# EAGLE schematic Motherboard - Rev2 (EAGLE 9.5.2)
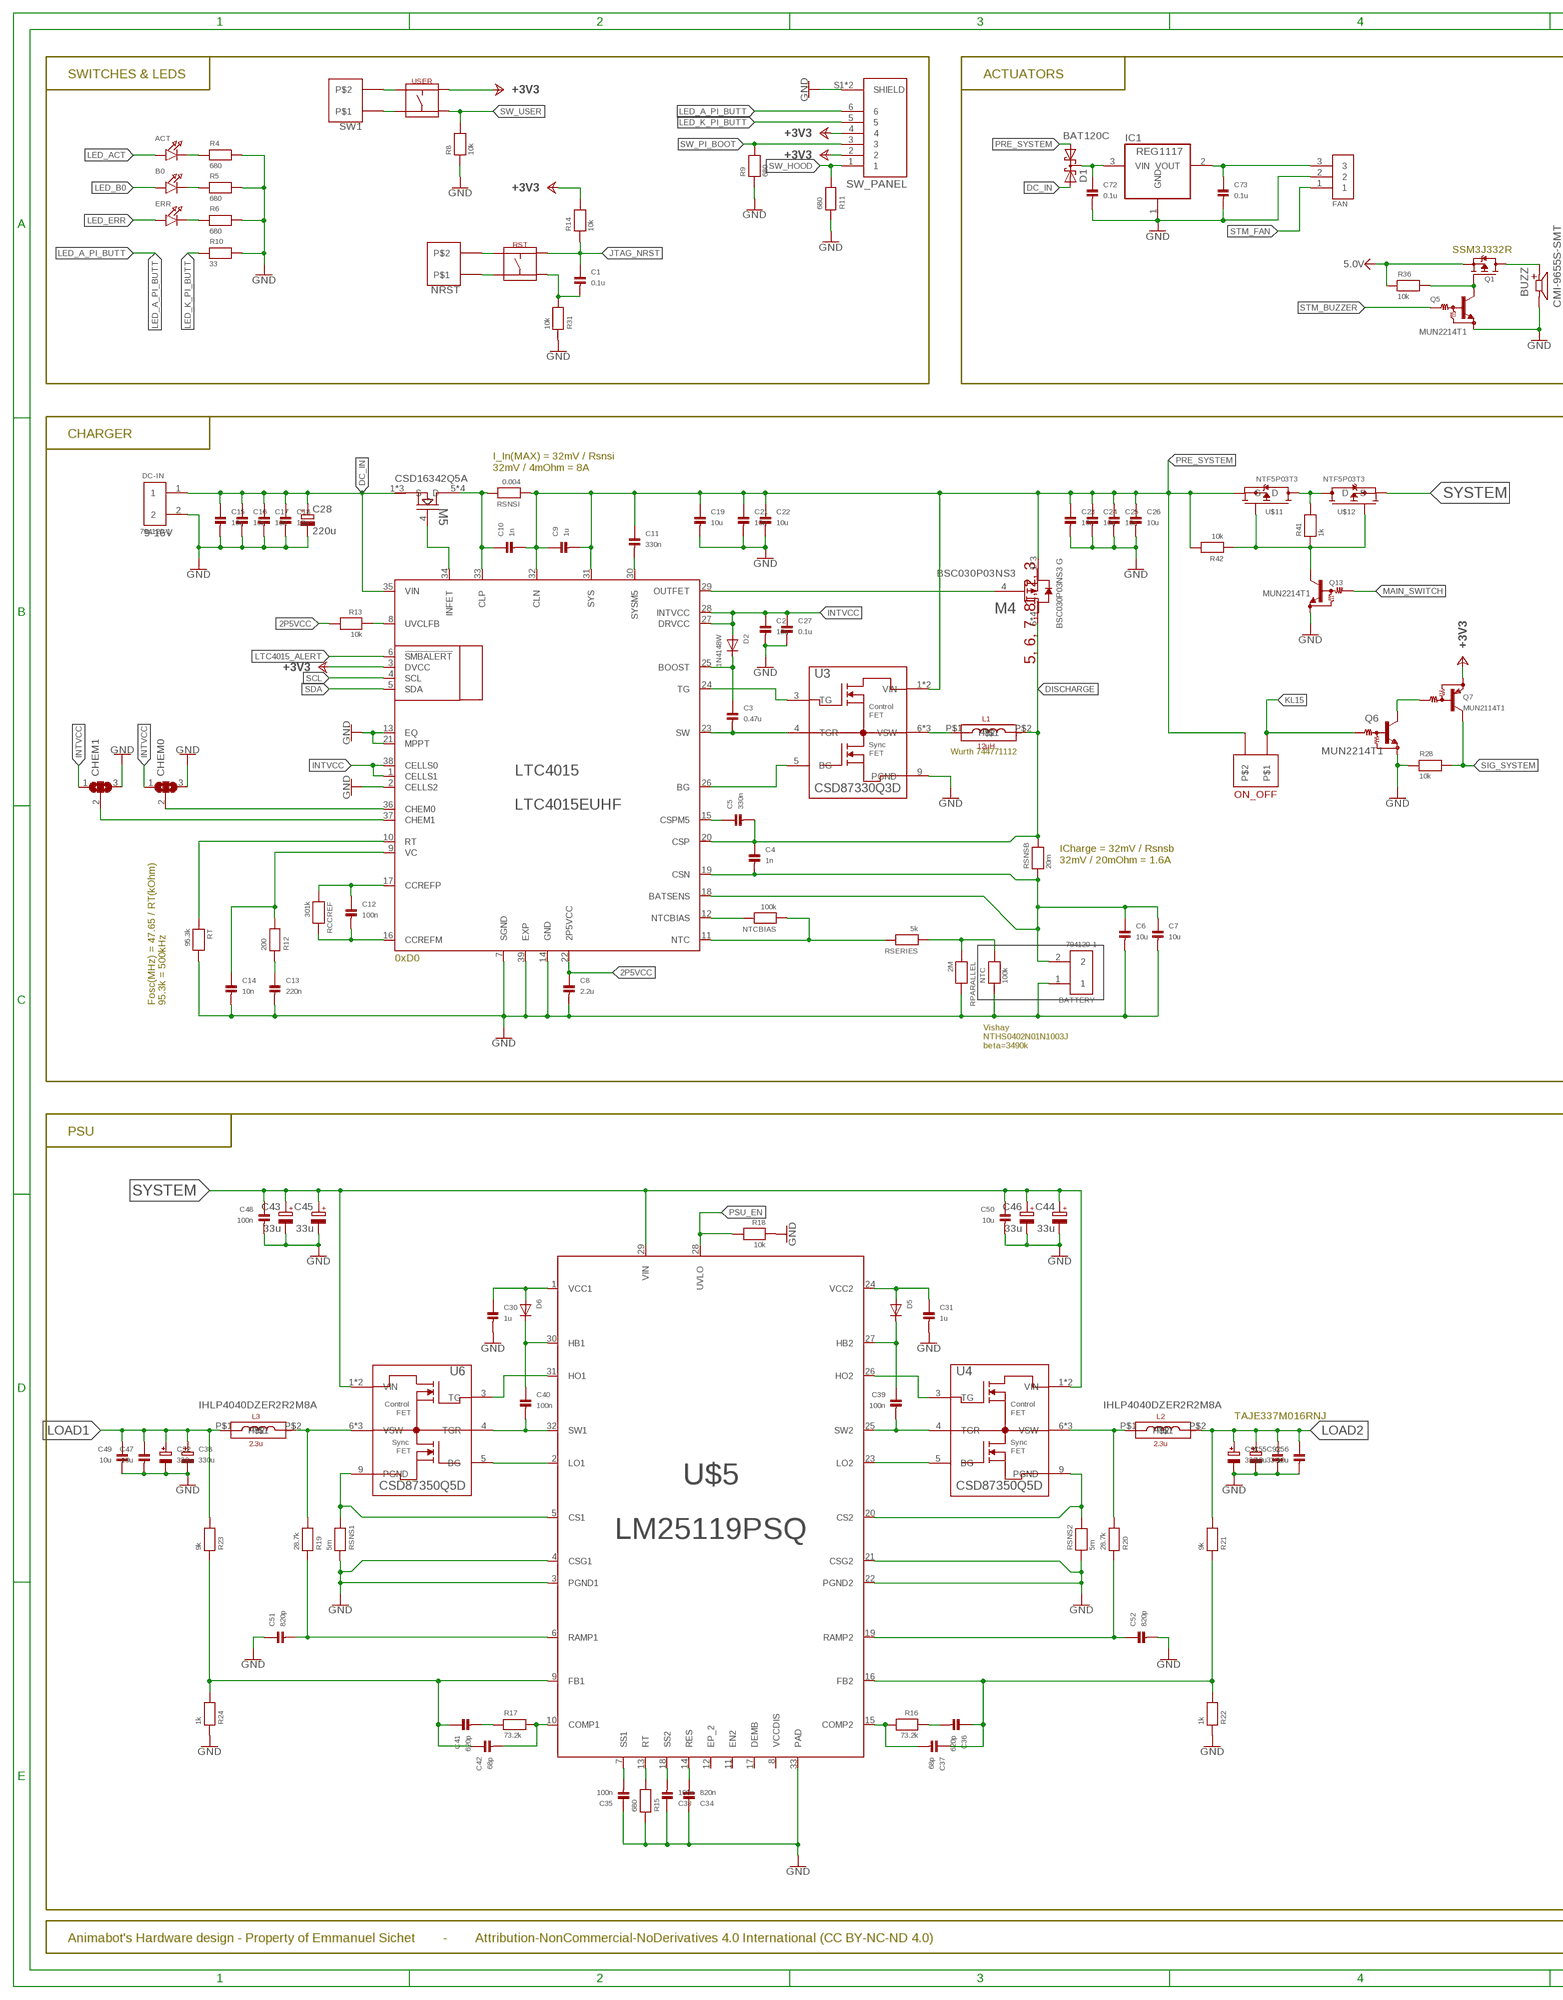
[diagram p0: schematic, sheet 1, part 1 of 2]
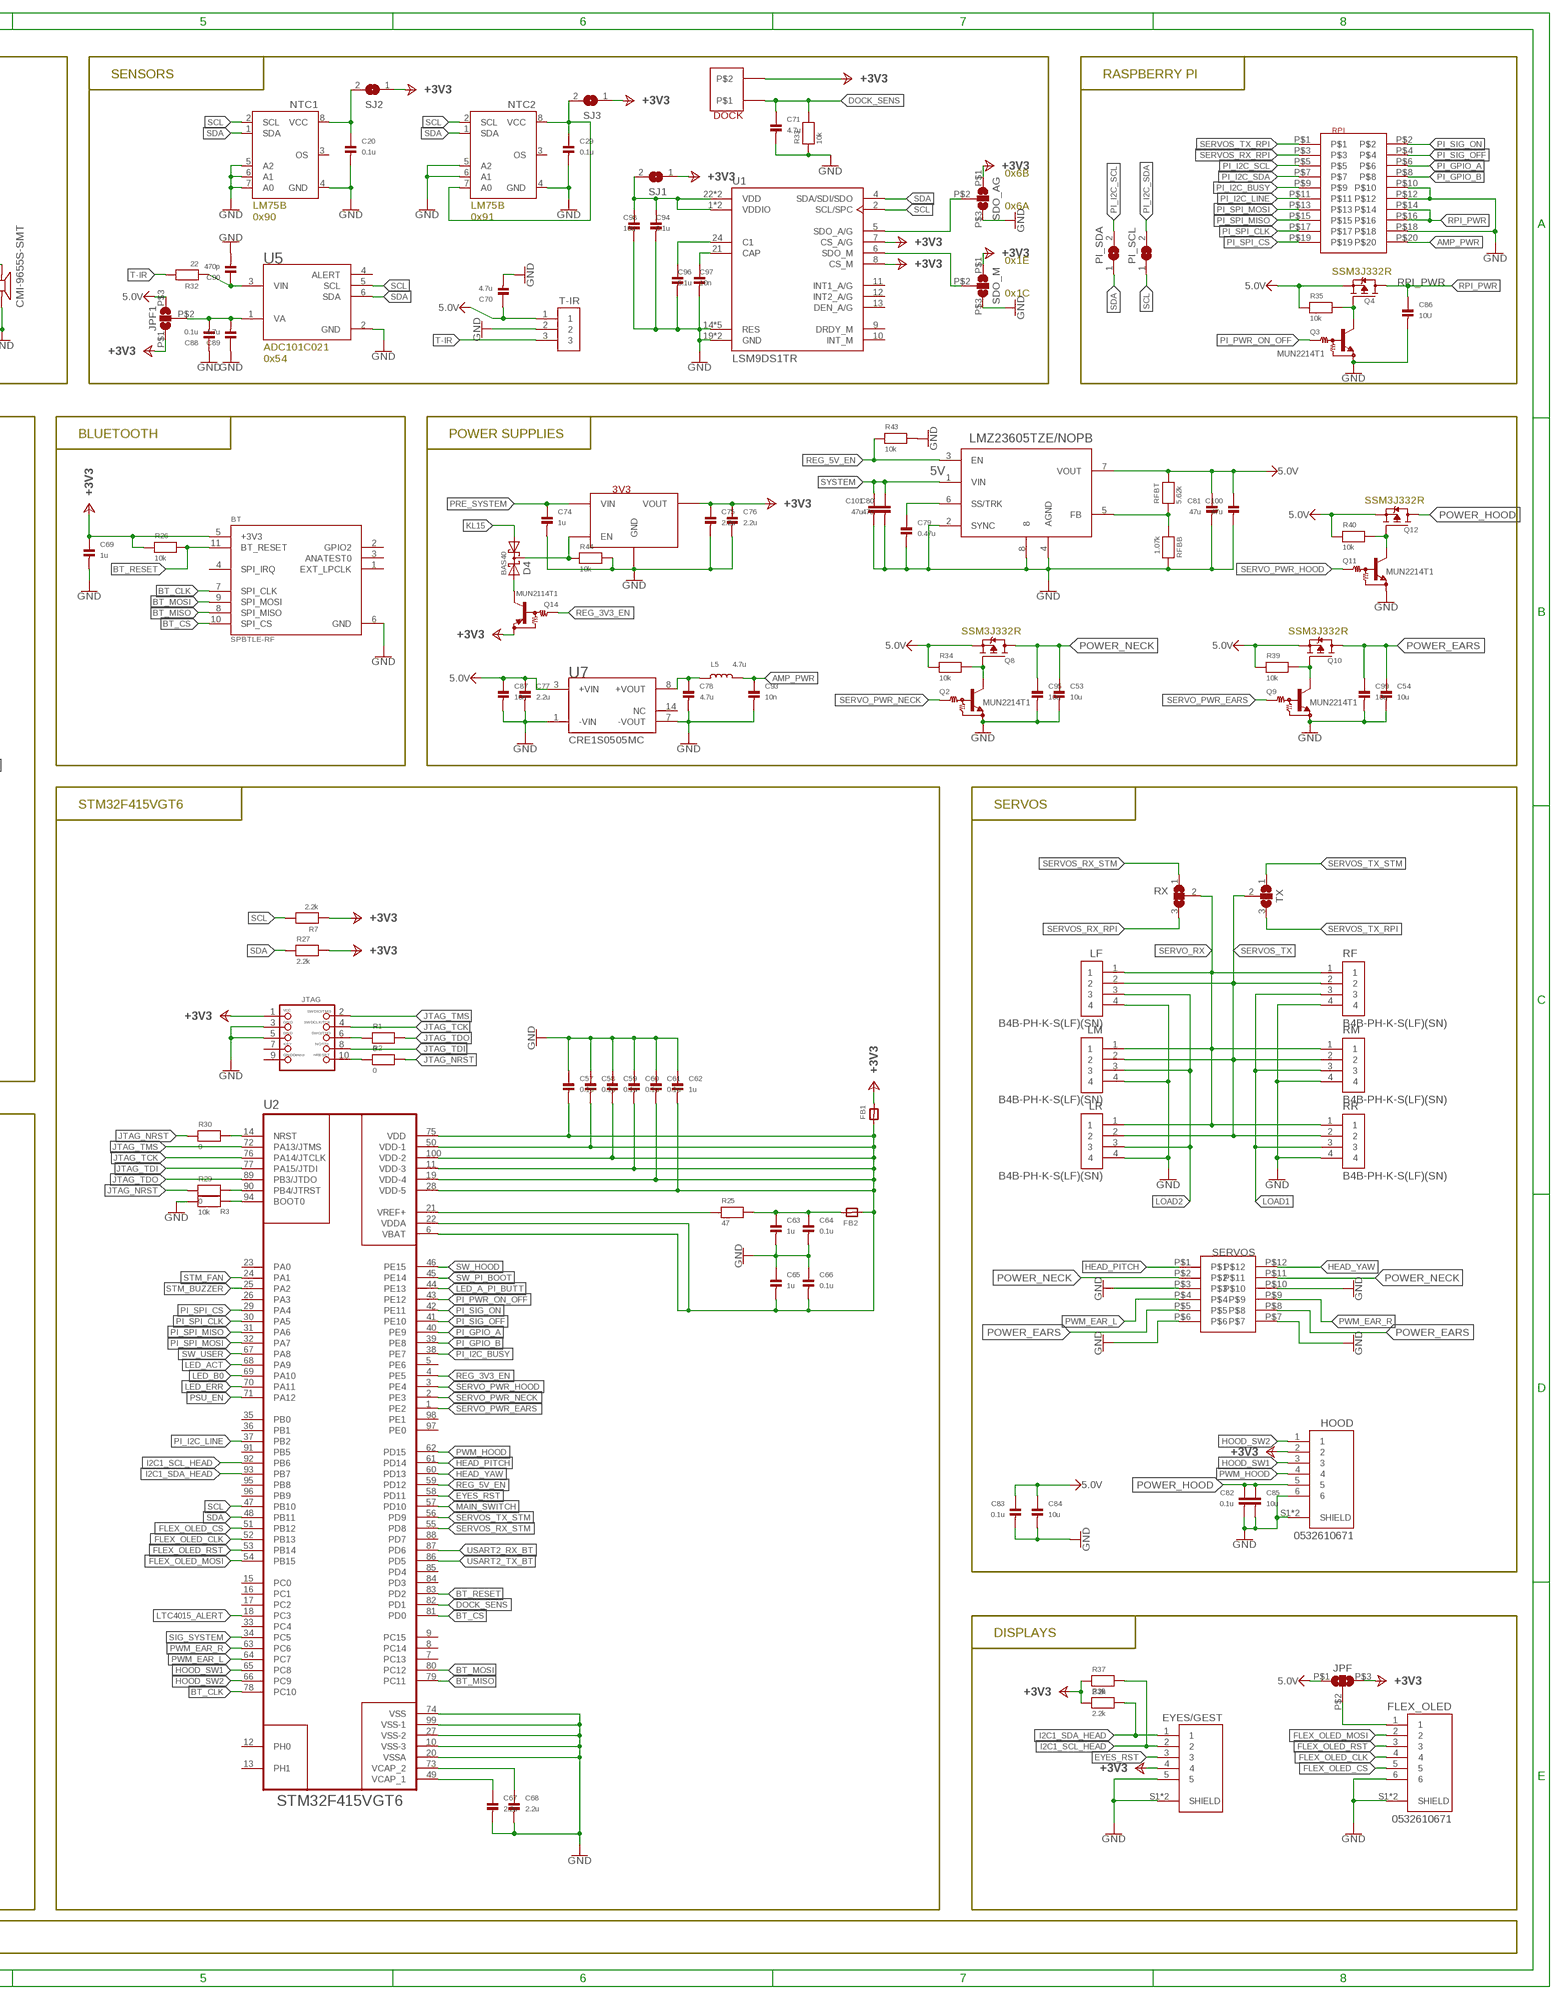
[diagram p1: schematic, sheet 1, part 2 of 2]

## Parts
3V3  NCP5500DT-33.50-RKG  [NCP5500DT-33.50-RKG]
5V  LMZ23605TZE/NOPB  [TZA07A]
ACT  LED0805  [CHIPLED_0805]
B0  LED0805  [CHIPLED_0805]
BATTERY  794120-1  [TE_794120-1]
BT  SPBTLE-RF  [XCVR_SPBTLE-RF]
BUZZ  CMI-9655S-SMT  [CUI_CMI-9655S-SMT]
C1  0.1u  CAP_CERAMIC0805  [0805]
C2  10u  CAP_CERAMIC0805  [0805]
C3  0.47u  CAP_CERAMIC0805  [0805]
C4  1n  CAP_CERAMIC0805  [0805]
C5  330n  CAP_CERAMIC0805  [0805]
C6  10u  CAP_CERAMIC1206  [1206]
C7  10u  CAP_CERAMIC1206  [1206]
C8  2.2u  CAP_CERAMIC0805  [0805]
C9  1u  CAP_CERAMIC0805  [0805]
C10  1n  CAP_CERAMIC0805  [0805]
C11  330n  CAP_CERAMIC0805  [0805]
C12  100n  CAP_CERAMIC0805  [0805]
C13  220n  CAP_CERAMIC0805  [0805]
C14  10n  CAP_CERAMIC0805  [0805]
C15  10u  CAP_CERAMIC1206  [1206]
C16  10u  CAP_CERAMIC1206  [1206]
C17  10u  CAP_CERAMIC1206  [1206]
C18  10u  CAP_CERAMIC1206  [1206]
C19  10u  CAP_CERAMIC1206  [1206]
C20  0.1u  CAP_CERAMIC0805  [0805]
C21  10u  CAP_CERAMIC1206  [1206]
C22  10u  CAP_CERAMIC1206  [1206]
C23  10u  CAP_CERAMIC1206  [1206]
C24  10u  CAP_CERAMIC1206  [1206]
C25  10u  CAP_CERAMIC1206  [1206]
C26  10u  CAP_CERAMIC1206  [1206]
C27  0.1u  CAP_CERAMIC0805  [0805]
C28  220u  CPOL-EUUD-10X10  [UD-10X10_NICHICON]
C29  0.1u  CAP_CERAMIC0805  [0805]
C30  1u  CAP_CERAMIC0805  [0805]
C31  1u  CAP_CERAMIC0805  [0805]
C32  330u  CAP_TANTALUMD/7343_REFLOW  [EIA7343-31/D-R]
C33  100n  CAP_CERAMIC0805  [0805]
C34  820n  CAP_CERAMIC0805  [0805]
C35  100n  CAP_CERAMIC0805  [0805]
C36  620p  CAP_CERAMIC0805  [0805]
C37  68p  CAP_CERAMIC0805  [0805]
C38  330u  CAP_TANTALUMD/7343_REFLOW  [EIA7343-31/D-R]
C39  100n  CAP_CERAMIC0805  [0805]
C40  100n  CAP_CERAMIC0805  [0805]
C41  620p  CAP_CERAMIC0805  [0805]
C42  68p  CAP_CERAMIC0805  [0805]
C43  33u  CPOL-EUUD-6,3X7,7  [UD-6,3X7,7_NICHICON]
C44  33u  CPOL-EUUD-6,3X7,7  [UD-6,3X7,7_NICHICON]
C45  33u  CPOL-EUUD-6,3X7,7  [UD-6,3X7,7_NICHICON]
C46  33u  CPOL-EUUD-6,3X7,7  [UD-6,3X7,7_NICHICON]
C47  10u  CAP_CERAMIC1206  [1206]
C48  100n  CAP_CERAMIC1206  [1206]
C49  10u  CAP_CERAMIC1206  [1206]
C50  10u  CAP_CERAMIC1206  [1206]
C51  820p  CAP_CERAMIC0805  [0805]
C52  820p  CAP_CERAMIC0805  [0805]
C53  10u  CAP_CERAMIC1206  [1206]
C54  10u  CAP_CERAMIC1206  [1206]
C55  10u  CAP_CERAMIC1206  [1206]
C56  10u  CAP_CERAMIC1206  [1206]
C57  0.1u  CAP_CERAMIC0805  [0805]
C58  0.1u  CAP_CERAMIC0805  [0805]
C59  0.1u  CAP_CERAMIC0805  [0805]
C60  0.1u  CAP_CERAMIC0805  [0805]
C61  0.1u  CAP_CERAMIC0805  [0805]
C62  1u  CAP_CERAMIC0805  [0805]
C63  1u  CAP_CERAMIC0805  [0805]
C64  0.1u  CAP_CERAMIC0805  [0805]
C65  1u  CAP_CERAMIC0805  [0805]
C66  0.1u  CAP_CERAMIC0805  [0805]
C67  2.2u  CAP_CERAMIC0805  [0805]
C68  2.2u  CAP_CERAMIC0805  [0805]
C69  1u  CAP_CERAMIC0805  [0805]
C70  4.7u  CAP_CERAMIC0805  [0805]
C71  4.7u  CAP_CERAMIC0805  [0805]
C72  0.1u  CAP_CERAMIC0805  [0805]
C73  0.1u  CAP_CERAMIC0805  [0805]
C74  1u  CAP_CERAMIC0805  [0805]
C75  2.2u  CAP_CERAMIC0805  [0805]
C76  2.2u  CAP_CERAMIC0805  [0805]
C77  2.2u  CAP_CERAMIC0805  [0805]
C78  4.7u  CAP_CERAMIC0805  [0805]
C79  0.47u  CAP_CERAMIC0805  [0805]
C80  47u  CAP_CERAMIC1206  [1206]
C81  47u  CAP_CERAMIC1206  [1206]
C82  0.1u  CAP_CERAMIC0805  [0805]
C83  0.1u  CAP_CERAMIC0805  [0805]
C84  10u  CAP_CERAMIC1206  [1206]
C85  10u  CAP_CERAMIC1206  [1206]
C86  10U  CAP_CERAMIC0805  [0805]
C87  10n  CAP_CERAMIC0805  [0805]
C88  0.1u  CAP_CERAMIC0805  [0805]
C89  4.7u  CAP_CERAMIC0805  [0805]
C90  470p  CAP_CERAMIC0805  [0805]
C91  330u  CAP_TANTALUMD/7343_REFLOW  [EIA7343-31/D-R]
C92  330u  CAP_TANTALUMD/7343_REFLOW  [EIA7343-31/D-R]
C93  10n  CAP_CERAMIC0805  [0805]
C94  0.1u  CAP_CERAMIC0805  [0805]
C95  10u  CAP_CERAMIC1206  [1206]
C96  0.1u  CAP_CERAMIC0805  [0805]
C97  10n  CAP_CERAMIC0805  [0805]
C98  10u  CAP_CERAMIC0805  [0805]
C99  10u  CAP_CERAMIC1206  [1206]
C100  47u  CAP_CERAMIC1206  [1206]
C101  47u  CAP_CERAMIC1206  [1206]
CHEM0  SJ2W  [SJ_2]
CHEM1  SJ2W  [SJ_2]
D1  BAT120C  [SOT223]
D2  1N4148W  DIODESOD-123  [SOD-123]
D4  BAS40  BAS40-05  [SOT23]
D5  DIODESOD-123  [SOD-123]
D6  DIODESOD-123  [SOD-123]
DC-IN  794120-1  [TE_794120-1]
DOCK  MOLEX_53398  [MOLEX_53398]
ERR  LED0805  [CHIPLED_0805]
EYES/GEST  0532610571  [MOLEX_0532610571]
FAN  0532610371  [MOLEX_0532610371]
FB1  FERRITE_0805  [_0805]
FB2  FERRITE_0805  [_0805]
FLEX_OLED  0532610671  [MOLEX_0532610671]
HOOD  0532610671  [MOLEX_0532610671]
IC1  REG1117  [SOT223]
JPF  SJ2WSJ_3  [SJ_3]
JPF1  SJ2WSJ_3  [SJ_3]
JTAG  JTAG-CORTEXM3  [2X05_1.27MM_SMT]
L1  12µH  SRR1210-680MTR  [SRR1210-680MTR]
L2  2.3u  SRR1210-680MTR  [SRR1210-680MTR]
L3  2.3u  SRR1210-680MTR  [SRR1210-680MTR]
L5  4.7u  INDUCTOR0805  [0805]
LF  B4B-PH-K-S(LF)(SN)  [JST_B4B-PH-K-S(LF)(SN)]
LM  B4B-PH-K-S(LF)(SN)  [JST_B4B-PH-K-S(LF)(SN)]
LR  B4B-PH-K-S(LF)(SN)  [JST_B4B-PH-K-S(LF)(SN)]
LTC4015  LTC4015EUHF  LTC4015EUHF#PBF  [QFN50P700X500X80-39N]
M4  INFINEON_BSC030P03NS3_GINFINEON_BSC030P03NS3_G_0_0  [INFINEON_BSC030P03NS3_G_0]
M5  CSD16342Q5A-REV2  [DQJ8]
NRST  MOLEX_53398  [MOLEX_53398]
NTC  100k  RESISTOR1206  [1206]
NTC1  TEMP_LM75B  [TSSOP8]
NTC2  TEMP_LM75B  [TSSOP8]
NTCBIAS  100k  RESISTOR0805  [0805]
ON_OFF  MOLEX_53398  [MOLEX_53398]
PI_SCL  SOLDERJUMPERREFLOW  [SOLDERJUMPER_REFLOW]
PI_SDA  SOLDERJUMPERREFLOW  [SOLDERJUMPER_REFLOW]
Q1  MOSFET-PWIDE  [SOT23-WIDE]
Q2  MUN2214T1  [SC59-BEC]
Q3  MUN2214T1  [SC59-BEC]
Q4  MOSFET-PWIDE  [SOT23-WIDE]
Q5  MUN2214T1  [SC59-BEC]
Q6  MUN2214T1  [SC59-BEC]
Q7  MUN2114T1  [SC59-BEC]
Q8  MOSFET-PWIDE  [SOT23-WIDE]
Q9  MUN2214T1  [SC59-BEC]
Q10  MOSFET-PWIDE  [SOT23-WIDE]
Q11  MUN2214T1  [SC59-BEC]
Q12  MOSFET-PWIDE  [SOT23-WIDE]
Q13  MUN2214T1  [SC59-BEC]
Q14  MUN2114T1  [SC59-BEC]
R1  0  RESISTOR0805  [0805]
R2  0  RESISTOR0805  [0805]
R3  10k  RESISTOR0805  [0805]
R4  680  RESISTOR0805  [0805]
R5  680  RESISTOR0805  [0805]
R6  680  RESISTOR0805  [0805]
R7  2.2k  RESISTOR0805  [0805]
R8  10k  RESISTOR0805  [0805]
R9  680  RESISTOR0805  [0805]
R10  33  RESISTOR0805  [0805]
R11  680  RESISTOR0805  [0805]
R12  200  RESISTOR0805  [0805]
R13  10k  RESISTOR0805  [0805]
R14  10k  RESISTOR0805  [0805]
R15  680  RESISTOR0805  [0805]
R16  73.2k  RESISTOR0805  [0805]
R17  73.2k  RESISTOR0805  [0805]
R18  10k  RESISTOR0805  [0805]
R19  28.7k  RESISTOR0805  [0805]
R20  28.7k  RESISTOR0805  [0805]
R21  9k  RESISTOR0805  [0805]
R22  1k  RESISTOR0805  [0805]
R23  9k  RESISTOR0805  [0805]
R24  1k  RESISTOR0805  [0805]
R25  47  RESISTOR0805  [0805]
R26  10k  RESISTOR0805  [0805]
R27  2.2k  RESISTOR0805  [0805]
R28  10k  RESISTOR0805  [0805]
R29  0  RESISTOR0805  [0805]
R30  0  RESISTOR0805  [0805]
R31  10k  RESISTOR0805  [0805]
R32  22  RESISTOR0805  [0805]
R33  10k  RESISTOR0805  [0805]
R34  10k  RESISTOR0805  [0805]
R35  10k  RESISTOR0805  [0805]
R36  10k  RESISTOR0805  [0805]
R37  2.2k  RESISTOR0805  [0805]
R38  2.2k  RESISTOR0805  [0805]
R39  10k  RESISTOR0805  [0805]
R40  10k  RESISTOR0805  [0805]
R41  1k  RESISTOR0805  [0805]
R42  10k  RESISTOR0805  [0805]
R43  10k  RESISTOR0805  [0805]
R44  10k  RESISTOR0805  [0805]
RCCREF  301k  RESISTOR0805  [0805]
RF  B4B-PH-K-S(LF)(SN)  [JST_B4B-PH-K-S(LF)(SN)]
RFBB  1.07k  RESISTOR0805  [0805]
RFBT  5.62k  RESISTOR0805  [0805]
RM  B4B-PH-K-S(LF)(SN)  [JST_B4B-PH-K-S(LF)(SN)]
RPARALLEL  2M  RESISTOR0805  [0805]
RPI  DF50-20DP-1V  [DF50-20DP-1V]
RR  B4B-PH-K-S(LF)(SN)  [JST_B4B-PH-K-S(LF)(SN)]
RSERIES  5k  RESISTOR0805  [0805]
RSNS1  5m  RESISTOR2012  [2012]
RSNS2  5m  RESISTOR2012  [2012]
RSNSB  20m  RESISTOR2012  [2012]
RSNSI  0.004  RESISTOR2012  [2012]
RST  MJTP1140ATR  [MJTP1140ATR]
RT  95.3k  RESISTOR0805  [0805]
RX  SJ2W  [SJ_2]
SDO_AG  SJ2WSJ_3  [SJ_3]
SDO_M  SJ2WSJ_3  [SJ_3]
SERVOS  BM12B-ZPDSS-TF  [BM12B-ZPDSS-TF]
SJ1  SOLDERJUMPER  [SOLDERJUMPER_ARROW_NOPASTE]
SJ2  SOLDERJUMPER  [SOLDERJUMPER_ARROW_NOPASTE]
SJ3  SOLDERJUMPER  [SOLDERJUMPER_ARROW_NOPASTE]
SW1  MOLEX_53398  [MOLEX_53398]
SW_PANEL  0532610671  [MOLEX_0532610671]
T-IR  0532610371  [MOLEX_0532610371]
TX  SJ2W  [SJ_2]
U1  LSM9DS1TR  [PQFN43P300X350X102-24N]
U2  STM32F415VGT6  [QFP50P1600X1600X160-100N]
U3  CSD87330Q3D  CSD87330Q3DCSD87335Q3D  [DQZ8_1P8X2P7]
U4  CSD87350Q5D  [DQY8_3P2X4P3]
U5  TEXAS_INSTRUMENTS_ADC101C021CIMK-NOPBTEXAS_INSTRUMENTS_ADC101C021CIMK-NOPB_0_0  [TEXAS_INSTRUMENTS_ADC101C021CIMK-NOPB_0]
U6  CSD87350Q5D  [DQY8_3P2X4P3]
U7  CRE1S0505MC  R1SE-0505  [SOIC254P1110X700-5N]
U$5  LM25119PSQ  LM25119PSQ/NOPB  [SQA32A]
U$11  NTF5P03T3  [SOT223]
U$12  NTF5P03T3  [SOT223]
USER  MJTP1140ATR  [MJTP1140ATR]

## Nets
2P5VCC: C8.1 LTC4015.22(2P5VCC) R13.2
5.0V: 5V.7(VOUT) C70.1 C77.1 C81.1 C83.1 C84.1 C87.1 C100.1 JPF1.P$3 JPF.P$1 Q1.2(S) Q4.2(S) Q8.2(S) Q10.2(S) Q12.2(S) R34.1 R35.1 R36.1 R39.1 R40.1 RFBT.2 T-IR.1 U7.3(+VIN)
5V_FAN: C73.1 FAN.3 IC1.2(VOUT)
+3V3: 3V3.VOUT BT.5(+3V3) C69.1 C75.1 C76.1 DOCK.P$2 EYES/GEST.4 FB1.2 HOOD.2 JPF1.P$1 JPF.P$3 JTAG.1 LTC4015.3(DVCC) Q7.E Q14.E R7.1 R14.2 R26.1 R27.2 R37.1 R38.1 SDO_AG.P$1 SDO_M.P$1 SJ1.1 SJ2.1 SJ3.1 SW_PANEL.2 SW_PANEL.4 U1.7(CS_A/G) U1.8(CS_M) USER.P$2
AMP_PWR: C93.1 L5.2 RPI.P$20
BATT: BATTERY.2 C4.2 C6.1 C7.1 LTC4015.18(BATSENS) LTC4015.19(CSN) RSNSB.1
BG: LTC4015.26(BG) U3.5(BG)
BT_CLK: BT.7(SPI_CLK) U2.78(PC10)
BT_CS: BT.10(SPI_CS) U2.81(PD0)
BT_MISO: BT.8(SPI_MISO) U2.79(PC11)
BT_MOSI: BT.9(SPI_MOSI) U2.80(PC12)
BT_RESET: BT.11(BT_RESET) R26.2 U2.83(PD2)
CCREFM: C12.2 LTC4015.16(CCREFM) RCCREF.2
CCREFP: C12.1 LTC4015.17(CCREFP) RCCREF.1
CHEM0: CHEM0.2 LTC4015.36(CHEM0)
CHEM1: CHEM1.2 LTC4015.37(CHEM1)
CLP: C10.1 LTC4015.33(CLP) M5.5(D) M5.6(D) M5.7(D) M5.8(D) RSNSI.2
COMP1: C42.2 R17.2 U$5.10(COMP1)
COMP2: C37.2 R16.2 U$5.15(COMP2)
CS1: RSNS1.2 U6.9(PGND) U$5.5(CS1)
CS2: RSNS2.2 U4.9(PGND) U$5.20(CS2)
DC_IN: C15.1 C16.1 C17.1 C18.1 C28.+ D1.3(A2) DC-IN.1 LTC4015.35(VIN) M5.1(S) M5.2(S) M5.3(S)
DISCHARGE: C4.1 C5.2 L1.P$2 LTC4015.20(CSP) M4.5(2_DRAIN) M4.6(2_DRAIN) M4.7(2_DRAIN) M4.8(2_DRAIN) RSNSB.2
DOCK_SENS: C71.1 DOCK.P$1 R33.2 U2.82(PD1)
EYES_RST: EYES/GEST.3 U2.58(PD11)
FB1: C41.1 C42.1 R23.1 R24.2 U$5.9(FB1)
FB2: C36.1 C37.1 R21.1 R22.2 U$5.16(FB2)
FLEX_OLED_CLK: FLEX_OLED.4 U2.52(PB13)
FLEX_OLED_CS: FLEX_OLED.5 U2.51(PB12)
FLEX_OLED_MOSI: FLEX_OLED.2 U2.54(PB15)
FLEX_OLED_RST: FLEX_OLED.3 U2.53(PB14)
GND: 3V3.GND 5V.2(SYNC) 5V.4(AGND) 5V.8 BATTERY.1 BT.6(GND) BUZZ.N C2.2 C6.2 C7.2 C8.2 C13.2 C14.2 C15.2 C16.2 C17.2 C18.2 C19.2 C20.2 C21.2 C22.2 C23.2 C24.2 C25.2 C26.2 C27.2 C28.- C29.2 C30.2 C31.2 C32.- C33.1 C34.1 C35.1 C38.- C43.- C44.- C45.- C46.- C47.2 C48.2 C49.2 C50.2 C51.1 C52.2 C53.2 C54.2 C55.2 C56.2 C57.1 C58.1 C59.1 C60.1 C61.1 C62.1 C63.2 C64.2 C65.1 C66.1 C67.2 C68.2 C69.2 C70.2 C71.2 C72.2 C73.2 C74.2 C75.2 C76.2 C77.2 C78.2 C79.2 C80.2 C81.2 C82.2 C83.2 C84.2 C85.2 C86.2 C87.2 C88.1 C89.1 C90.2 C91.- C92.- C93.2 C94.2 C95.2 C96.2 C97.2 C98.2 C99.2 C100.2 C101.2 CHEM0.3 CHEM1.3 DC-IN.2 EYES/GEST.5 EYES/GEST.S1(SHIELD) EYES/GEST.S2(SHIELD) FAN.2 FLEX_OLED.6 FLEX_OLED.S1(SHIELD) FLEX_OLED.S2(SHIELD) HOOD.6 HOOD.S1(SHIELD) HOOD.S2(SHIELD) IC1.1(GND) JTAG.3 JTAG.5 LF.4 LM.4 LR.4 LTC4015.2(CELLS2) LTC4015.7(SGND) LTC4015.13(EQ) LTC4015.14(GND) LTC4015.21(MPPT) LTC4015.39(EXP) NTC1.4(GND) NTC1.5(A2) NTC1.6(A1) NTC1.7(A0) NTC2.4(GND) NTC2.5(A2) NTC2.6(A1) NTC.1 Q2.E Q3.E Q5.E Q6.E Q9.E Q11.E Q13.E R3.1 R4.2 R5.2 R6.2 R8.1 R9.1 R10.2 R11.1 R15.1 R18.1 R22.1 R24.1 R28.1 R31.1 R33.1 R43.2 R44.2 RF.4 RFBB.2 RM.4 RPARALLEL.2 RPI.P$10 RPI.P$12 RPI.P$18 RR.4 RSNS1.1 RSNS2.1 RT.2 SDO_AG.P$3 SDO_M.P$3 SERVOS.P$3 SERVOS.P$6 SERVOS.P$7 SERVOS.P$10 SW_PANEL.S1(SHIELD) SW_PANEL.S2(SHIELD) T-IR.2 U1.14(RES) U1.15(RES) U1.16(RES) U1.17(RES) U1.18(RES) U1.19(GND) U1.20(GND) U2.10(VSS-3) U2.20(VSSA) U2.27(VSS-2) U2.74(VSS) U2.99(VSS-1) U3.9(PGND) U5.2(GND) U7.1(-VIN) U7.7(-VOUT) U$5.3(PGND1) U$5.4(CSG1) U$5.21(CSG2) U$5.22(PGND2) U$5.33(PAD)
HEAD_PITCH: SERVOS.P$1 U2.61(PD14)
HEAD_YAW: SERVOS.P$12 U2.60(PD13)
HO1: U6.3(TG) U$5.31(HO1)
HO2: U4.3(TG) U$5.26(HO2)
HOOD_SW1: HOOD.3 U2.65(PC8)
HOOD_SW2: HOOD.1 U2.66(PC9)
I2C1_SCL_HEAD: EYES/GEST.2 R37.2 U2.92(PB6)
I2C1_SDA_HEAD: EYES/GEST.1 R38.2 U2.93(PB7)
INFET: LTC4015.34(INFET) M5.4(G)
INTVCC: C2.1 C27.1 CHEM0.1 CHEM1.1 D2.A LTC4015.1(CELLS1) LTC4015.27(DRVCC) LTC4015.28(INTVCC) LTC4015.38(CELLS0)
JTAG_NRST: C1.1 R2.2 R14.1 R29.1 R30.1 RST.P$2
JTAG_TCK: JTAG.4 U2.76(PA14/JTCLK)
JTAG_TDI: JTAG.8 U2.77(PA15/JTDI)
JTAG_TDO: R1.2 U2.89(PB3/JTDO)
JTAG_TMS: JTAG.2 U2.72(PA13/JTMS)
KL15: D4.1(A1) ON_OFF.P$1 Q6.B
LED_A_PI_BUTT: SW_PANEL.6 U2.44(PE13)
LED_ACT: ACT.A U2.68(PA9)
LED_B0: B0.A U2.69(PA10)
LED_ERR: ERR.A U2.70(PA11)
LED_K_PI_BUTT: R10.1 SW_PANEL.5
LO1: U6.5(BG) U$5.2(LO1)
LO2: U4.5(BG) U$5.23(LO2)
LOAD1: C32.+ C38.+ C47.1 C49.1 L3.P$1 R23.2 RF.3 RM.3 RR.3
LOAD2: C55.1 C56.1 C91.+ C92.+ L2.P$2 LF.3 LM.3 LR.3 R21.2
LTC4015_ALERT: LTC4015.6(!SMBALERT) U2.18(PC3)
MAIN_SWITCH: Q13.B U2.57(PD10)
N$1: C90.1 R32.1 U5.3(VIN)
N$2: NRST.P$1 RST.P$4
N$3: Q2.C Q8.1(G) R34.2
N$4: Q3.C Q4.1(G) R35.2
N$5: ERR.C R6.1
N$6: B0.C R5.1
N$7: JTAG.6 R1.1
N$8: JTAG.10 R2.1
N$9: ACT.C R4.1
N$10: C72.1 D1.4(K1K2) IC1.3(VIN)
N$11: NRST.P$2 RST.P$1
N$12: Q9.C Q10.1(G) R39.2
N$13: C78.1 L5.1 U7.8(+VOUT)
N$14: LTC4015.12(NTCBIAS) NTCBIAS.2
N$15: Q11.C Q12.1(G) R40.2
N$16: C3.1 D2.C LTC4015.25(BOOST)
N$17: R29.2 U2.90(PB4/JTRST)
N$18: R3.2 U2.94(BOOT0)
N$19: R41.2 U$11.4(D) U$12.4(D)
N$20: C5.1 LTC4015.15(CSPM5)
N$21: Q13.C R41.1 R42.1 U$11.1(G) U$12.1(G)
N$22: Q1.1(G) Q5.C R36.2
N$23: Q6.C Q7.B
N$24: R30.2 U2.14(NRST)
N$25: SW1.P$1 USER.P$4
N$26: 3V3.EN D4.3(C) R44.1
N$27: C13.1 R12.1
N$28: D4.2(A2) Q14.C
N$29: C1.2 R31.2 RST.P$3
N$30: C68.1 U2.73(VCAP_2)
N$31: LTC4015.8(UVCLFB) R13.1
N$32: R15.2 U$5.13(RT)
N$33: C67.1 U2.49(VCAP_1)
N$34: BUZZ.P Q1.3(D)
N$35: R25.1 U2.21(VREF+)
N$36: C36.2 R16.1
N$37: C57.2 C58.2 C59.2 C60.2 C61.2 C62.2 C65.2 C66.2 FB1.1 FB2.1 U2.6(VBAT) U2.11(VDD-3) U2.19(VDD-4) U2.22(VDDA) U2.28(VDD-5) U2.50(VDD-1) U2.75(VDD) U2.100(VDD-2)
N$38: C63.1 C64.1 FB2.2 R25.2
N$39: C39.1 D5.C U$5.27(HB2)
N$40: NTC.2 RPARALLEL.1 RSERIES.1
N$41: C96.1 U1.24(C1)
N$42: C97.1 U1.21(CAP)
N$43: SDO_M.P$2 U1.6(SDO_M)
N$44: SDO_AG.P$2 U1.5(SDO_A/G)
N$45: FLEX_OLED.1 JPF.P$2
N$46: C88.2 C89.2 JPF1.P$2 U5.1(VA)
N$47: SW1.P$2 USER.P$1
N$48: C40.1 D6.C U$5.30(HB1)
N$49: 5V.5(FB) RFBB.1 RFBT.1
N$50: C20.1 NTC1.8(VCC) SJ2.2
N$51: C41.2 R17.1
N$52: C94.1 C98.1 SJ1.2 U1.1(VDDIO) U1.3(VDDIO) U1.22(VDD) U1.23(VDD)
N$53: 5V.6(SS/TRK) C79.1
N$54: C29.1 NTC2.7(A0) NTC2.8(VCC) SJ3.2
N$57: L3.P$2 R19.2 U6.6(VSW) U6.7(VSW) U6.8(VSW)
N$58: L2.P$1 R20.2 U4.6(VSW) U4.7(VSW) U4.8(VSW)
NTC: LTC4015.11(NTC) NTCBIAS.1 RSERIES.2
OUTFET: LTC4015.29(OUTFET) M4.4(GATE)
PI_GPIO_A: RPI.P$6 U2.40(PE9)
PI_GPIO_B: RPI.P$8 U2.39(PE8)
PI_I2C_BUSY: RPI.P$9 U2.38(PE7)
PI_I2C_LINE: RPI.P$11 U2.37(PB2)
PI_I2C_SCL: PI_SDA.2 RPI.P$5
PI_I2C_SDA: PI_SCL.2 RPI.P$7
PI_PWR_ON_OFF: Q3.B U2.43(PE12)
PI_SIG_OFF: RPI.P$4 U2.41(PE10)
PI_SIG_ON: RPI.P$2 U2.42(PE11)
PI_SPI_CLK: RPI.P$17 U2.30(PA5)
PI_SPI_CS: RPI.P$19 U2.29(PA4)
PI_SPI_MISO: RPI.P$15 U2.31(PA6)
PI_SPI_MOSI: RPI.P$13 U2.32(PA7)
POWER_EARS: C54.1 C99.1 Q10.3(D) SERVOS.P$5 SERVOS.P$8
POWER_HOOD: C82.1 C85.1 HOOD.5 Q12.3(D)
POWER_NECK: C53.1 C95.1 Q8.3(D) SERVOS.P$2 SERVOS.P$11
PRE_SYSTEM: 3V3.VIN C9.1 C9.2 C10.2 C11.1 C19.1 C21.1 C22.1 C23.1 C24.1 C25.1 C26.1 C74.1 D1.1(A1) LTC4015.31(SYS) LTC4015.32(CLN) M4.1(2_SOURCE) M4.2(2_SOURCE) M4.3(2_SOURCE) ON_OFF.P$2 R42.2 RSNSI.1 U3.1(VIN) U3.2(VIN) U$11.3(S)
PSU_EN: R18.2 U2.71(PA12) U$5.28(UVLO)
PWM_EAR_L: SERVOS.P$4 U2.64(PC7)
PWM_EAR_R: SERVOS.P$9 U2.63(PC6)
PWM_HOOD: HOOD.4 U2.62(PD15)
RAMP1: C51.2 R19.1 U$5.6(RAMP1)
RAMP2: C52.1 R20.1 U$5.19(RAMP2)
REG_3V3_EN: Q14.B U2.4(PE5)
REG_5V_EN: 5V.3(EN) R43.1 U2.59(PD12)
RES: C34.2 U$5.14(RES)
RPI_PWR: C86.1 Q4.3(D) RPI.P$14 RPI.P$16
RT: LTC4015.10(RT) RT.1
SCL: LTC4015.4(SCL) NTC1.2(SCL) NTC2.2(SCL) PI_SCL.1 R7.2 U1.2(SCL/SPC) U2.47(PB10) U5.5(SCL)
SDA: LTC4015.5(SDA) NTC1.1(SDA) NTC2.1(SDA) PI_SDA.1 R27.1 U1.4(SDA/SDI/SDO) U2.48(PB11) U5.6(SDA)
SERVO_PWR_EARS: Q9.B U2.1(PE2)
SERVO_PWR_HOOD: Q11.B U2.3(PE4)
SERVO_PWR_NECK: Q2.B U2.2(PE3)
SERVO_RX: LF.1 LM.1 LR.1 RF.1 RM.1 RR.1 RX.2
SERVOS_RX_RPI: RPI.P$3 RX.3
SERVOS_RX_STM: RX.1 U2.55(PD8)
SERVOS_TX: LF.2 LM.2 LR.2 RF.2 RM.2 RR.2 TX.2
SERVOS_TX_RPI: RPI.P$1 TX.3
SERVOS_TX_STM: TX.1 U2.56(PD9)
SIG_SYSTEM: Q7.C R28.2 U2.34(PC5)
SS1: C35.2 U$5.7(SS1)
SS2: C33.2 U$5.18(SS2)
STM_BUZZER: Q5.B U2.25(PA2)
STM_FAN: FAN.1 U2.24(PA1)
SW1: C40.2 U6.4(TGR) U$5.32(SW1)
SW2: C39.2 U4.4(TGR) U$5.25(SW2)
SW_HOOD: R11.2 SW_PANEL.1 U2.46(PE15)
SW_PI_BOOT: R9.2 SW_PANEL.3 U2.45(PE14)
SW_USER: R8.2 U2.67(PA8) USER.P$3
SYSMS: C11.2 LTC4015.30(SYSM5)
SYSTEM: 5V.1(VIN) C43.+ C44.+ C45.+ C46.+ C48.1 C50.1 C80.1 C101.1 U4.1(VIN) U4.2(VIN) U6.1(VIN) U6.2(VIN) U$5.29(VIN) U$12.3(S)
T-IR: R32.2 T-IR.3
TG: LTC4015.24(TG) U3.3(TG)
TGR: C3.2 LTC4015.23(SW) U3.4(TGR)
USART2_RX_BT: U2.87(PD6)
USART2_TX_BT: U2.86(PD5)
VC: C14.1 LTC4015.9(VC) R12.2
VCC1: C30.1 D6.A U$5.1(VCC1)
VCC2: C31.1 D5.A U$5.24(VCC2)
VSW: L1.P$1 U3.6(VSW) U3.7(VSW) U3.8(VSW)
Unconnected: BT.1(EXT_LPCLK) BT.2(GPIO2) BT.3(ANATEST0) BT.4(SPI_IRQ) JTAG.7 JTAG.9 NTC1.3(OS) NTC2.3(OS) U1.9(DRDY_M) U1.10(INT_M) U1.11(INT1_A/G) U1.12(INT2_A/G) U1.13(DEN_A/G) U2.5(PE6) U2.7(PC13) U2.8(PC14) U2.9(PC15) U2.12(PH0) U2.13(PH1) U2.15(PC0) U2.16(PC1) U2.17(PC2) U2.23(PA0) U2.26(PA3) U2.33(PC4) U2.35(PB0) U2.36(PB1) U2.84(PD3) U2.85(PD4) U2.88(PD7) U2.91(PB5) U2.95(PB8) U2.96(PB9) U2.97(PE0) U2.98(PE1) U5.4(ALERT) U7.14(NC) U$5.8(VCCDIS) U$5.11(EN2) U$5.12(EP_2) U$5.17(DEMB)

## Notes on the sheet
- SWITCHES & LEDS | ACTUATORS | SENSORS | RASPBERRY PI
- 0x6B
- 0x6A
- LM75B
  0x90
- LM75B
  0x91
- SSM3J332R
- 0x1E
- SSM3J332R
- 0x1C
- ADC101C021
  0x54
- CHARGER | BLUETOOTH | POWER SUPPLIES
- I_In(MAX) = 32mV / Rsnsi
  32mV / 4mOhm = 8A
- CSD16342Q5A
- SSM3J332R
- 9-16V
- BSC030P03NS3
- SSM3J332R | SSM3J332R
- Wurth 744771112
- STM32F415VGT6 | SERVOS
- ICharge = 32mV / Rsnsb
  32mV / 20mOhm = 1.6A
- 0xD0
- Fosc(MHz) = 47.65 / RT(kOhm)
  95.3k = 500kHz
- Vishay 
  NTHS0402N01N1003J 
  beta=3490k
- PSU
- IHLP4040DZER2R2M8A | IHLP4040DZER2R2M8A
- TAJE337M016RNJ
- DISPLAYS
- Animabot's Hardware design - Property of Emmanuel Sichet        -        Attribution-NonCommercial-NoDerivatives 4.0 International (CC BY-NC-ND 4.0)

## Library data of the parts
3V3 = _myLib:NCP5500DT-33.50-RKG
5V = _Animabot:LMZ23605TZE/NOPB; MANUFACTURER_PART_NUMBER: LMZ23605TZENOPB; VENDOR: Texas Instruments
ACT B0 ERR = microbuilder:LED: LED 0603 - 0603 Surface Mount Package 2mA: Green LED - Low Power (3.9mcd, 2ma, 1.7Vf) - Digikey: 475-2709-2-ND Orange LED - Low Power (9.8mcd, 2ma, 1.8Vf) - Digikey: 475-1194-2-ND Red LED - Low Power (5mcd, 2ma, 1.8Vf) - Digikey: 475-1195-2-ND Yellow LED - Low Power (7mcd, 2ma, 1.8Vf) - Digikey: 475-1196-2-ND 5mA: Blue LED - Low Power (17mcd, 5ma, 2.9Vf) - Digikey: LNJ937W8CRACT-ND 0805 - 0805 Surface Mount Package 2mA: Red LED (8.8mcd, 2mA, 1.8Vf, Clear) - Low Power [Digikey: 475-2510-1-ND] Green LED (5mcd, 2mA, 1.8Vf, Clear) - Low Power [Digikey: 475-2730-1-ND] Yellow LED (11.3mcd, 2mA, 1.8Vf, Clear) - Low Power [Digikey: 475-2555-1-ND] 20mA: Red LED (104mcd, 20mA, Diffused) - LS R976 [Digikey: 475-1278-6-ND] Red LED (12mcd, 20mA, 2.0Vf, Clear) - APT2012EC [Digikey: 754-1128-1-ND] Green LED (15mcd, 20mA, 2.2Vf, Clear) - APT2012GC [Digikey: 754-1131-1-ND] Orange LED (160mcd, 20mA, 2.1Vf, Clear) - APT2012SECK [Digikey: 754-1130-1-ND] 1206 - 1206 Surface Mount Package Green LED (26mcd, 20mA, Diffused) - LG N971 [Digikey: 475-1407-6-ND] Red LED (15mcd, 20mA, Diffused) - LH N974 [Digikey: 475-1416-6-ND]
BATTERY DC-IN = 794120-1:794120-1: Conn Power HDR 2 POS 5.08mm Solder RA Thru-Hole 2 Terminal 1 Port Bag; AVAILABILITY: Unavailable; DESCRIPTION: Conn Power HDR 2 POS 5.08mm Solder RA Thru-Hole 2 Terminal 1 Port Automotive Bag; MF: TE Connectivity; MP: 794120-1; PACKAGE: None; PRICE: None
BT = SPBTLE-RF:SPBTLE-RF: Very low power module for Bluetooth Smart v4.1; AVAILABILITY: Unavailable; DESCRIPTION: Very low power module for Bluetooth Smart v4.1; MF: STMicroelectronics; MP: SPBTLE-RF; PACKAGE: SMD-11 STMicroelectronics; PRICE: None
BUZZ = CMI-9655S-SMT:CMI-9655S-SMT: 9.6 mm, 5 Vdc, 85 dB, 2.7 kHz, Surface Mount (SMT), Driving Circuit, Magnetic Audio Indicator Buzzer; MANUFACTURER: CUI INC; PARTREV: 1.0; STANDARD: Manufacturer recommendations
C1-C27 C29-C31 C33-C37 C39-C42 C47-C90 C93-C101 = microbuilder:CAP_CERAMIC: Ceramic Capacitors 0402 - 0402 Surface Mount Capacitors 16pF 50V 5% [Digikey: 445-4899-2-ND] 18pF 50V 5% [Digikey: 490-1281-2-ND] 22pF 50V 5% [Digikey: 490-1283-2-ND] 68pF 50V 5% [Digikey: 490-1289-2-ND] 0.1uF 10V 10% [Digikey: 490-1318-2-ND] 1.0uF 6.3V 10% [Digikey: 490-1320-2-ND] 0603 - 0603 Surface Mount Capacitors 16 pF 50V 5% [Digikey: 445-5051-2-ND] 22 pF 50V [Digikey: PCC220ACVTR-ND] 33 pF 50V 5% [Digikey: 490-1415-1-ND] 56pF 50V 5% [Digikey: 490-1421-1-ND] 220pF 50V 5% [Digikey: 445-1285-1-ND] 680 pF 50V 2200 pF 50V 5% C0G [Digikey: 445-1297-1-ND] 5600 pF 100V 5% X7R [Digikey: 478-3711-1-ND] 0.1 µF 25V 10% [Digikey: PCC2277TR-ND] 0.22 µF 16V 10% X7R [Digikey: 445-1318-1-ND] 1.0 µF 25V 10% [Digikey: 445-5146-2-ND] 0603 - RF Specific 3pF 250V +/-0.1pF RF [Digikey: 712-1347-1-ND] 18 pF 250V 5% [Digikey: 478-3505-1-ND or 712-1322-1-ND] 56 pF 250V 5% C0G RF [Digikey: 490-4867-1-ND] 68 pF 250V RF [Digikey: 490-4868-1-ND] 0805 - 0805 Surface Mount Capacitors 220 pF 250V 2% RF Ceramic Capacitor [Digikey: 712-1398-1-ND] 1000 pF 50V 2% NP0 Ceramic Capacitor [Digikey: 478-3760-1-ND] 0.1 µF 25V 10% Ceramic Capacitor [Digikey: PCC1828TR-ND] 1.0 µF 16V 10% Ceramic Capacitor[Digikey: 490-1691-2-ND] 10.0 µF 10V 10% Ceramic Capacitor[Digikey: 709-1228-1-ND] 10.0 uF 16V 10% Ceramic Capacitor [Digikey: 478-5165-2-ND] 47 uF 6.3V 20% Ceramic Capacitor [Digikey: 587-1779-1-ND or 399-5506-1-ND] 1206 - 1206 Surface Mount Capacitors 47uF 10V 20% Ceramic Capacitor [Digikey: 490-5528-1-ND or 399-5508-1-ND or 445-6010-1-ND] 100uF 6.3V -20%, +80% Y5V Ceramic Capacitor (Digikey: 490-4512-1-ND, Mouser: 81-GRM31CF50J107ZE1L)
C28 C43-C46 = rcl:CPOL-EU: POLARIZED CAPACITOR, European symbol
C32 C38 C91 C92 = microbuilder:CAP_TANTALUM: Tantalum Capacitors Wave footprints have larger pads and are meant to be used for hand soldering. Reflow footprints are optimised for solder paste and a reflow oven. EIA3216-18/A-[R/W] - Size A / 3216-18 / 1206 footprint 4.7µF 25V 10% Tantalum Capacitor 10µF 16V 10% Tantalum Capacitor [Digikey: 495-2236-2-ND] EIA3528-21/B-[R/W] - Size B / 3528-21 47µF 10V 10% Tantalum Capactior [Digikey: 495-2216-1-ND] EIA6032-28/C-[R/W] - Size C / 6032-28 10µF 35V 20% Tantalum Capacitor [Digikey: 495-2285-1-ND] 100µF 16V 10% Tantalum Capactior [Digikey: 399-5214-1-ND]
CHEM0 CHEM1 JPF JPF1 RX SDO_AG SDO_M TX = jumper:SJ2W: SMD solder JUMPER
D1 = NXP_60_26022015:BAT120C: Schottky barrier double diodes Planar Schottky barrier double diodes encapsulated in a SOT223 plastic SMD package. AAL Eindhoven MK
D2 D5 D6 = microbuilder:DIODE: Diode SMA Model Volts Amps Type Vf Vr Digikey # Notes SSA34-E3 40V 3A Schottky 480mV @ 3A 200uA @ 40V SSA34-E3/61TGITR-ND CDBA120-G 20V 1A Schottky 500mV @ 1A 500uA @ 20V 641-1014-6-ND REEL MBRA210 10V 2A Schottky 350mV @ 2A 700uA @ 10V MBRA210LT3 SOD-123 Model Volts Amps Type Vf Vr Order # Notes BAT54T1G 30V 200mA Schottky 800mV @ 200mA 2uA @ 25V BAT54T1GOSTR-ND B0530W 30V 500mA Schottky 430mV @ 500mA 130uA @ 30V B0530W-FDICT-ND REEL MBR120 1A 20V Schottky 340mV @ 1A MBR120VLSFT1GOSCT-ND SOD-323 Model Volts Amps Type Vf Vr Order # Notes PMEG2005EJ 20V 500mA Schottky 355mV @ 500mA 568-4110-1-ND ZLLS410 10V 570mA Schottky 380mV @ 570mA ZLLS410CT-ND 1N4148WS 75V 150mA Silicon/Simple 1V 1N4148WSFSCT-ND REEL SOD-523 Model Volts Amps Type Vf Vr Order # Notes BAT54XV2 30V 200mA Schottky 0.8V @ 100mA BAT54XV2CT-ND TB751S 30V 30mA Schottky RB751S-40TE61CT-ND SOT23-R/W (R = Solder Paste/Reflow Ovens, W = Hand-Soldering) Model Volts Amps Type Vf Vr Order # Notes BAT54FILM 40V 300mA Schottky 497-7162-1-ND
D4 = diode:BAS40-05: Silicon Schottky Diodes General-purpose diode for high-speed switching
DOCK NRST ON_OFF SW1 = _myLib:MOLEX_53398
EYES/GEST = 0532610571:0532610571: CONN HEADER 5POS 1.25MM R/A SMD; AVAILABILITY: Unavailable; DESCRIPTION: 1.25mm _.049_ Pitch PicoBlade Header, Surface Mount, Right Angle, Lead-free, 5 Circuits; MF: Molex, LLC; MP: 0532610571; PACKAGE: None; PRICE: None
FAN T-IR = 0532610371:0532610371: 1.25mm (.049") Pitch PicoBlade Header, Surface Mount, Right Angle, Lead-free, 3 Circuits; AVAILABILITY: Unavailable; DESCRIPTION: 1.25mm _.049_ Pitch PicoBlade Header, Surface Mount, Right Angle, Lead-free, 3 Circuits; MF: Molex, LLC; MP: 0532610371; PACKAGE: None; PRICE: None
FB1 FB2 = microbuilder:FERRITE: Ferrite Bead 0603 MMZ1608B121C - 120 Ohm @ 100MHz, 600mA, 0.15 Ohm DC Resistance - Digikey: 445-2164-1-ND BK1608HW121-T - 120 Ohm, 600mA Ferrite Chip - Digikey: 587-1876-2-ND 0805 HZ0805B272R-10 - 2.7K Ohm @ 100MHz, 200mA, 0.8 Ohm DC Resistance - Digikey: 240-2504-1-ND (see also Murata BLM21BD272SN1L) MMZ2012Y152B - 1.5K Ohm @ 100MHz, 500mA, 0.4 Ohm DC Resistance - Digikey: 445-1560-1-ND - Mainly for high frequency (80-400MHz) MMZ2012R102A - 1K Ohm @ 100MHz, 500mA, 0.3 Ohm DC Resistance - Digikey: 445-1555-2-ND - More general purpose (10-200MHz)
FLEX_OLED HOOD = 0532610671:0532610671: 1.25mm Pitch PicoBlade™ Header, Surface Mount, Right Angle, 6 Circuits; AVAILABILITY: Unavailable; DESCRIPTION: 1.25mm _.049_ Pitch PicoBlade Header, Surface Mount, Right Angle, Lead-free, 6 Circuits; MF: Molex, LLC; MP: 0532610671; PACKAGE: None; PRICE: None
IC1 = burr-brown:REG1117: 800mA and 1A Low Dropout (LDO) Positive Regulator 1.8V, 2.5V, 2.85V, 3.3V, 5V, and Adj; MPN: REG1117; OC_FARNELL: 1097566; OC_NEWARK: 14P6981
JTAG = microbuilder:JTAG-CORTEXM3: Serial Wire (SW-DP) Connector This standard 0.05" 10-pin connector is for use with the Cortex M0/M3's native SWD (serial wire debugger) interface (SW-DP). Some boards support a 20-pin combined JTAG+SWD connector (SWJ-DP), such as the LPC1700 family, but many smaller devices only work with SWD which typically use the smaller 10-pin SW-DP connecter (the LPC1300 family, for example, only supports SWD). 2x05 1.27mm/0.05" Connector: This is the standard SMT connector defined by ARM for all Cortex devices, and should be used in most situations and for forward-compatibility since any new devices coming to market will likely use this connector. MOLEX 10 Pin 0.1" Connector: This 0.1" 10 pin connector has the same pin layout as the standard 0.05" connector, but is easier to work with if you are using standard jumper wires or custom cables to connect your SWD hardware. MOLEX 20 Pin 0.1" Connector: This 0.1" 20 pin connector is the same model used for ARM7/ARM9 JTAG debuggers, but is connected to match the pins on the Segger J-Link for ARM (which supports both JTAG and SWD debugging). See the following document from ARM for more information on Cortex M3 Debug Connectors: http://infocenter.arm.com/help/topic/com.arm.doc.faqs/attached/13634/cortex_debug_connectors.pdf And the following page for an overview with images of the different connector types: http://www.keil.com/peripherals/coresight/connectors.asp
L1-L3 = _myLib:SRR1210-680MTR
L5 = microbuilder:INDUCTOR: Inductors 0603: 10nH Ceramic Inductor - microwire antenna/RF (Digikey: 712-1434-2-ND) 0805: 560nH Ceramic Inductor - RF (Digikey: 553-1047-1-ND) 270nH Ceramic Inductor - Q = 40@250MHz, +-5%, 1 Ohm DC Resistance (Digikey: 535-10506-2-ND) 1007 (2518 Metric) SMT: 10µH 10% 250mOhm 820mA 1007 Inductor (Digikey: 587-2189-1-ND) 22µH 10% 500mOhm 580mA 1007 Inductor (Digikey: 587-2190-1-ND) 47µH 10% 950mOhm 420mA 1007 Inductor (Digikey: 587-2191-1-ND) 47µH 5% 100mOhm 1A 1008 Inductor (Digikey: 732-1816-1-ND) 5.0x5.0mm (Taiyo Yuden NR5040 Series) 6.8µH 20% 2.3A 64mOhm Inductor (Digikey: 587-2374-2-ND) 5.0x5.0mm (TDK VLC5045 Series) 4.7µH 20% 3.3A 34mOhm Inductor (Digikey: 445-6526-1-ND) 6.8µH 20% 2.7A 46mOhm Inductor (Digikey: 445-6527-1-ND) 6.0x6.0mm (TDK VLC6045 Series) 4.7µH 20% 3.8A 27mOhm Inductor (Digikey: 445-6538-2-ND) 6.8µH 20% 3A 41mOhm Inductor (Digikey: 445-6540-1-ND) 6.2µH 30% 2.2A 45mOhm Inductor (Digikey: SRR5028-6R2YCT-ND) - Not TDK VLC6045 but footprint should match 6.0x6.0mm (TDK SLF6045 Series) 6.8uH 30% 2A 33mOhm Inductor (Digikey: 445-4572-1-ND, Mouser: 810-SLF645T6R8N2R0PF)
LF LM LR RF RM RR = B4B-PH-K-S_LF__SN_:B4B-PH-K-S(LF)(SN): PH Series 4 Position 2 mm Pitch Through Hole Crimp Top Entry Shrouded Header; AVAILABILITY: Unavailable; DESCRIPTION: PH Series 4 Position 2 mm Pitch Through Hole Crimp Top Entry Shrouded Header; MF: JST Sales; MP: B4B-PH-K-S_LF__SN_; PACKAGE: None; PRICE: None
LTC4015 = _Animabot:LTC4015EUHF#PBF: LTC4015 - Multichemistry Buck Battery Charger Controller with Digital Telemetry System; AVAILABILITY: Unavailable; DESCRIPTION: LTC4015 - Multichemistry Buck Battery Charger Controller with Digital Telemetry System; MF: Linear Technology/Analog; MP: LTC4015EUHF#PBF; PACKAGE: QFN-38 Linear Technology; PRICE: None
M4 = _Animabot:INFINEON_BSC030P03NS3_G: INF-PEMOS-SSSGDDDD-8; CIIVA_IDS: 4153299; COMPONENT_LINK_1_DESCRIPTION: Manufacturer URL; COMPONENT_LINK_1_URL: http://www.infineon.com/; COMPONENT_LINK_3_DESCRIPTION: Package Specification; COMPONENT_LINK_3_URL: http://www.infineon.com/cms/packages/SMD_-_Surface_Mounted_Devices/P-PG-TDSON/P-PG-TDSON-08-01x_2x_3.html?__locale=en; DATASHEET: http://www.infineon.com/dgdl/BSC030P03NS3+G_2.1.pdf?folderId=db3a304314dca38901154a72e3951a65&fileId=db3a30431d8a6b3c011d90d084910435; DATASHEET_VERSION: Rev. 2.1; FOOTPRINT_VARIANT_NAME_0: Manufacturer Recommended; GREEN: true; HALOGEN_FREE: true; IDPULS_MAX: -200Â A; ID_MAX: -100Â A; IMPORTED: yes; IMPORTED_FROM: vault; IMPORT_TS: 1521845091; MF: Infineon; MOUNTING_TECHNOLOGY: Surface Mount; MPN: BSC030P03NS3 G; PACKAGE: PG-TDSON-8-1; PACKAGE_DESCRIPTION: 8-Pin Plastic (Green) Thin Dual Small Outline Non-Leaded Package, 5.15 x 5.9 mm Body, 1.27 mm Pitch; PACKING: Reel; PREFIX: Q; PTO_T_MAX: 125Â W; QG: 137Â nC; RDS_ON_MAX: 3Â mOhm; RELEASE_DATE: 1409249877; RTH: 1Â K/W; RTHJC_MAX: 1Â K/W; VAULT_GUID: A32F5749-7C01-47D7-BCF6-9E3178C51C40; VAULT_REVISION: 6090FA37-9E12-46BC-AF51-35F5BADCD2E5; VDS_MAX: -30Â V; VGSTH_MAX: -1.9Â V; VGSTH_MIN: -3.1Â V
M5 = _Animabot:CSD16342Q5A-REV2
NTC NTCBIAS R1-R44 RCCREF RFBB RFBT RPARALLEL RSERIES RSNS1 RSNS2 RSNSB RSNSI RT = microbuilder:RESISTOR: Resistors 0402 - 0402 Surface Mount Package 22 Ohm 1% 1/16W [Digikey: 311-22.0LRTR-ND] 33 Ohm 5% 1/16W 1.0K 5% 1/16W 1.5K 5% 1/16W 2.0K 1% 1/16W 10.0K 1% 1/16W [Digikey: 311-10.0KLRTR-ND] 10.0K 5% 1/16W [Digikey: RMCF0402JT10K0TR-ND] 12.1K 1% 1/16W [Digikey: 311-22.0LRTR-ND] 100.0K 5% 1/16W 0603 - 0603 Surface Mount Package 0 Ohm 1/10 Watt 1% Resistor 15 Ohm 1/10 Watt 1% Resistor 33 Ohm 1/10 Watt 1% Resistor 49.9 Ohm 1/10 Watt 1% Resistor 100 Ohm 1/10 Watt 1% Resistor 150 Ohm 1/10 Watt 1% Resistor 240 Ohm 1/10 Watt 1% Resistor 390 Ohm 1/10 Watt 1% Resistor 560 Ohm 1/10 Watt 1% Resistor 680 Ohm 1/10 Watt 1% Resistor 750 Ohm 1/10 Watt 1% Resistor 1.0K Ohm 1/10 Watt 1% Resistor 1.5K Ohm 1/10 Watt 1% Resistor 2.0K Ohm 1/10 Watt 1% Resistor 2.2K Ohm 1/10 Watt 1% Resistor 3.3K Ohm 1/10 Watt 1% Resistor 4.7K Ohm 1/10 Watt 1% Resistor 10.0K Ohm 1/10 Watt 1% Resistor 12.0K Ohm 1/10 Watt 1% Resistor 12.1K Ohm 1/10 Watt 1% Resistor 20.0K Ohm 1/10 Watt 1% Resistor 33.0K Ohm 1/10 Watt 1% Resistor 100.0K Ohm 1/10 Watt 1% Resistor 0805 - 0805 Surface Mount Package 0 Ohm 1/8 Watt 1% Resistor 33 Ohm 1/8 Watt 1% Resistor 100 Ohm 1/8 Watt 1% Resistor 150 Ohm 1/8 Watt 1% Resistor 200 Ohm 1/8 Watt 1% Resistor 240 Ohm 1/8 Watt 1% Resistor 330 Ohm 1/8 Watt 1% Resistor 390 Ohm 1/8 Watt 1% Resistor 470 Ohm 1/8 Watt 1% Resistor 1.0K Ohm 1/8 Watt 1% Resistor 1.5K Ohm 1/8 Watt 1% Resistor 2.0K Ohm 1/8 Watt 1% Resistor 4.7K Ohm 1/8 Watt 1% Resistor 5.1K Ohm 1/8 Watt 1% Resistor 5.6K Ohm 1/8 Watt 1% Resistor 10.0K Ohm 1/8 Watt 1% Resistor 22.0K Ohm 1/8 Watt 1% Resistor 33.0K Ohm 1/8 Watt 1% Resistor 100K Ohm 1/8 Watt 1% Resistor 1206 - 1206 Surface Mount Package 2012 - 2010 Surface Mount Package 0.11 Ohm 1/2 Watt 1% Resistor - Digikey: RHM.11UCT-ND
NTC1 NTC2 = microbuilder:TEMP_LM75B: LM75B I2C Temperature Sensor The I2C-based LM75B can measure temperature between -55 and 125°C in 0.125°C increments (11-bit resolution). Digikey: 568-4768-1-ND For a 1.8V compatible part, look at the following pin and SW compatible parts: DS75LV - Mouser: 700-DS75LVS, Digikey: (TSSOP8) DS75LVU+-ND (SOIC8) DS75LVS+-ND
PI_SCL PI_SDA = microbuilder:SOLDERJUMPER: SMD Solder JUMPER Solder the two pads together to create a connection, or remove the solder to break it. REFLOW - Use this footprint for solder paste and reflow ovens. WAVE - Use this footprint for hand-soldering (larger pads). CLOSED - Has a trace between the two pads to ensure it is closed by default. The trace needs to be cut to disable the jumper, and can be closed again by creating a solder bridge between the two pads.
Q1 Q4 Q8 Q10 Q12 = microbuilder:MOSFET-P: P-Channel Mosfet LEGEND VDS: Voltage Drain-Source ID: Drain Current RDS(ON): Drain-Source On-State Resistance VGS(TH): Gate-Source Threshold Voltage CISS: Drain-Source Input Capacitance SOT-23 Name VDS ID RDS(ON) VGS(TH) CISS Order Number IRLML5103 30V 760mA 600 mOhm -- 75pF @ 25V Digikey: IRLML5103PBFCT-ND IRLML6401 12V 4.3A 50 mOhm 950mV @ 250µA 830pF @ 10V Digikey: IRLML6401PBFTR-ND NTR0202PL 20V 400mA 800 mOhm 2.3V @ 250uA 70pF @ 5V Digikey: NTR0202PLT1GOSTR-ND NTR4101PT1G 20V 1.8A 85 mOhm 1.2V @ 250uA 675pF @ 10V Digikey: NTR4101PT1GOSCT-ND DMP2004K 20V 600mA 900 mOhm 1V @ 250uA 175pF @ 16V Digikey: DMP2004KDICT-ND PMV65XP 20V 3.9A 76 mOhm 950mV @ 1mA 725pF @ 20V Digikey: 568-2358-2-ND TO-252 Name VDS ID RDS(ON) VGS(TH) CISS Order Number AOD417 30V 25A 34 mOhm 3V @ 250µA 920pF @ 15V Digikey: 785-1106-2-ND
Q2 Q3 Q5 Q6 Q9 Q11 Q13 = transistor-npn:MUN2214*: NPN Bias Resistor Transistor
Q7 Q14 = transistor-pnp:MUN2114*: PNP Bias Resistor Transistor
RPI = _myLib:DF50-20DP-1V
RST USER = _myLib:MJTP1140ATR
SERVOS = _Animabot:BM12B-ZPDSS-TF
SJ1-SJ3 = microbuilder:SOLDERJUMPER: SMD Solder JUMPER Solder the two pads together to create a connection, or remove the solder to break it. REFLOW - Use this footprint for solder paste and reflow ovens. WAVE - Use this footprint for hand-soldering (larger pads). CLOSED - Has a trace between the two pads to ensure it is closed by default. The trace needs to be cut to disable the jumper, and can be closed again by creating a solder bridge between the two pads.; BOM: EXCLUDE
SW_PANEL = _myLib:0532610671: 1.25mm Pitch PicoBlade™ Header, Surface Mount, Right Angle, 6 Circuits; AVAILABILITY: Unavailable; DESCRIPTION: 1.25mm _.049_ Pitch PicoBlade Header, Surface Mount, Right Angle, Lead-free, 6 Circuits; MF: Molex, LLC; MP: 0532610671; PACKAGE: None; PRICE: None
U1 = LSM9DS1TR:LSM9DS1TR: The LSM9DS1 is a system-in-package featuring a 3D digital linear acceleration sensor, a 3D digital angular rate sensor, and a 3D digital magnetic sensor.; DESCRIPTION: LSM9DS1 Series ±2/±4/±8/±16 g 3D Digital Linear Acceleration Sensor - LGA-24; DIGI-KEY_PART_NUMBER: 497-14946-1-ND; DIGI-KEY_PURCHASE_URL: https://www.digikey.com/product-detail/en/stmicroelectronics/LSM9DS1TR/497-14946-1-ND/4988079?utm_source=snapeda&utm_medium=aggregator&utm_campaign=symbol; MF: STMicroelectronics; MP: LSM9DS1TR; PACKAGE: TFLGA-24 STMicroelectronics
U2 = STM32F415VGT6:STM32F415VGT6: None; AVAILABILITY: Good; DESCRIPTION: IC MCU 32BIT 1MB FLASH 100LQFP; MF: STMicroelectronics; MP: STM32F415VGT6; PACKAGE: LQFP-100 STMicroelectronics; PRICE: 10.50 USD
U3 = _Animabot:CSD87330Q3D
U4 U6 = _Animabot:CSD87350Q5D; MANUFACTURER_PART_NUMBER: CSD87350Q5D; VENDOR: Texas Instruments
U5 = ADC101C021CIMK:TEXAS_INSTRUMENTS_ADC101C021CIMK-NOPB: TEXAS INSTRUMENTS Analogue to Digital Converter, SAR, 10 bit, 188.9 kSPS, Single, 2.7 V, 5.5 V, TSOT-23; CENTROID_NOT_SPECIFIED: No; DATASHEET: http://www.ti.com/lit/ds/symlink/adc101c021.pdf; DIGIKEY_DESCRIPTION: IC ADC 10BIT SAR I2C TSOT-23-6; DIGIKEY_PART_NUMBER: ADC101C021CIMK/NOPBCT-ND; IPC_LAND_PATTERN_NAME: CAPC16080X45; LEAD_FREE: yes; MF: Texas Instruments; MFG_PACKAGE_IDENT: DDC0006A; MFG_PACKAGE_IDENT_DATE: 0; MFG_PACKAGE_IDENT_REV: 0; MOUSER_PART_NUMBER: 926-AD101C021CIMKNPB; MPN: ADC101C021CIMK/NOPB; PACKAGE: SOT-23; PREFIX: U; ROHS: yes; TEMPERATURE_RANGE_HIGH: +105°C; TEMPERATURE_RANGE_LOW: -40°C
U7 = R1SE-0505:R1SE-0505: R1SE Series 1 W 5 Vin 5 Vout ECONOLINE Surface Mount DC/DC-Converter; AVAILABILITY: Unavailable; DESCRIPTION: Recom Iso DC-DC Converter, Vin 4.5 to 5.5V dc, Vout 5V dc, I/O isolation 1kV dc; MF: Recom Power; MP: R1SE-0505; PACKAGE: SMD-8 Recom Power; PRICE: None
U$5 = _Animabot:LM25119PSQ/NOPB; DATASHEETURL: httpwww.ti.comproductlm25119; FREQUENCY: 750000.0; IMAX: 40.0; MANUFACTURER_NAME: Texas Instruments; MANUFACTURER_PART_NUMBER: LM25119PSQNOPB; MKTG_PACKAGE: NA; NSID: LM25119PSQNOPB; PACKAGE: NA; VENDOR: Texas Instruments
U$11 U$12 = transistor-fet:NTF5P03T3